# Altium project Cell Characterization Board V1.PrjPcb (part 1 of 2)
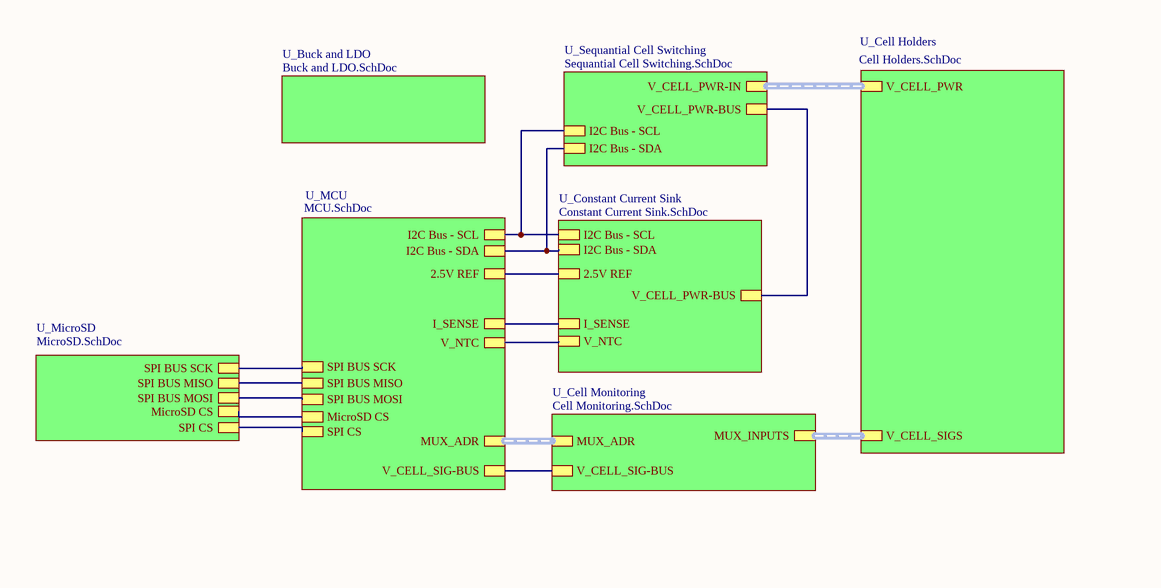
[diagram p0: TopLevel.SchDoc, top left]
CAGE_CODE: ?????; CONTRACT_NUMBER: <CONTRACT NO>; DOC_NO_ASSY_DWG: <ASSY DWG NO>; DOC_NO_BOM: <BOM DOC NO>; DOC_NO_FAB_DWG: <FAB DWG NO>; DOC_NO_SCH_DWG: <SCH DWG NO>; PCB_2_DEC_TOL: +/-.01; PCB_3_DEC_TOL: +/-.010; PCB_ANG_TOL: +/-1/2; PCB_ASSEMBLY_NO: <PCB ASSY NO>; PCB_CHECKER: - -----; PCB_CHECKER_APP_DATE: --/--/----; PCB_DESIGNER: - -----; PCB_DESIGNER_APP_DATE: --/--/----; PCB_DWG_NO: <PCB DWG NO>; PCB_ENGINEER: - -----; PCB_ENGINEER_APP_DATE: --/--/----; PCB_PART_NUMBER: <PCB PN>; PCB_REV: A; SCH_REV: A
8 sheets, 142 parts. Net scope: hierarchical (ports join the sheet entries above them; power ports are global).
Board file: Cell Characterization Board V1.2.PcbDoc
Sheets:
  TopLevel.SchDoc
    U_Buck and LDO = Buck and LDO.SchDoc
    U_Cell Holders = Cell Holders.SchDoc
    U_Cell Monitoring = Cell Monitoring.SchDoc
    U_Constant Current Sink = Constant Current Sink.SchDoc
    U_MCU = MCU.SchDoc
    U_MicroSD = MicroSD.SchDoc
    U_Sequantial Cell Switching = Sequantial Cell Switching.SchDoc

## Sheet TopLevel.SchDoc
size A; SheetNumber: 1; SheetTotal: 8

### Sub-sheets
U_Buck and LDO = Buck and LDO.SchDoc: no entries
U_Cell Holders = Cell Holders.SchDoc: V_CELL_SIGS (harness CELL_SIGS), V_CELL_PWR (harness CELL_PWR)
U_Cell Monitoring = Cell Monitoring.SchDoc: V_CELL_SIG-BUS, MUX_INPUTS (harness CELL_SIGS), MUX_ADR (harness MUX_ADR)
U_Constant Current Sink = Constant Current Sink.SchDoc: I2C Bus - SCL, I2C Bus - SDA, 2.5V REF, I_SENSE, V_NTC, V_CELL_PWR-BUS
U_MCU = MCU.SchDoc: SPI CS, 2.5V REF, MicroSD CS, SPI BUS MOSI, V_CELL_SIG-BUS, SPI BUS MISO, SPI BUS SCK, I2C Bus - SDA, I2C Bus - SCL, I_SENSE, V_NTC, MUX_ADR (harness MUX_ADR)
U_MicroSD = MicroSD.SchDoc: SPI CS, SPI BUS SCK, SPI BUS MISO, SPI BUS MOSI, MicroSD CS
U_Sequantial Cell Switching = Sequantial Cell Switching.SchDoc: I2C Bus - SCL, I2C Bus - SDA, V_CELL_PWR-BUS, V_CELL_PWR-IN (harness CELL_PWR)

### Nets
2.5V REF: sheet U_Constant Current Sink/2.5V REF, sheet U_MCU/2.5V REF
I2C_SCL: sheet U_Constant Current Sink/I2C Bus - SCL, sheet U_MCU/I2C Bus - SCL, sheet U_Sequantial Cell Switching/I2C Bus - SCL
I2C_SDA: sheet U_Constant Current Sink/I2C Bus - SDA, sheet U_MCU/I2C Bus - SDA, sheet U_Sequantial Cell Switching/I2C Bus - SDA
I_SENSE: sheet U_Constant Current Sink/I_SENSE, sheet U_MCU/I_SENSE
MicroSD_CS 5V: sheet U_MCU/MicroSD CS, sheet U_MicroSD/MicroSD CS
MOSFET_Temp: sheet U_Constant Current Sink/V_NTC, sheet U_MCU/V_NTC
MUX_OUT: sheet U_Cell Monitoring/V_CELL_SIG-BUS, sheet U_MCU/V_CELL_SIG-BUS
SPI_CS: sheet U_MCU/SPI CS, sheet U_MicroSD/SPI CS
SPI_MISO 5V: sheet U_MCU/SPI BUS MISO, sheet U_MicroSD/SPI BUS MISO
SPI_MOSI 5V: sheet U_MCU/SPI BUS MOSI, sheet U_MicroSD/SPI BUS MOSI
SPI_SCK 5V: sheet U_MCU/SPI BUS SCK, sheet U_MicroSD/SPI BUS SCK
NetMOSFET_CC_2: sheet U_Constant Current Sink/V_CELL_PWR-BUS, sheet U_Sequantial Cell Switching/V_CELL_PWR-BUS

### Buses and harness runs
harness sheet U_Cell Holders/V_CELL_PWR = sheet U_Sequantial Cell Switching/V_CELL_PWR-IN
harness sheet U_Cell Holders/V_CELL_SIGS = sheet U_Cell Monitoring/MUX_INPUTS
harness sheet U_Cell Monitoring/MUX_ADR = sheet U_MCU/MUX_ADR

## Sheet Buck and LDO.SchDoc
size A; SheetNumber: 2; SheetTotal: 8
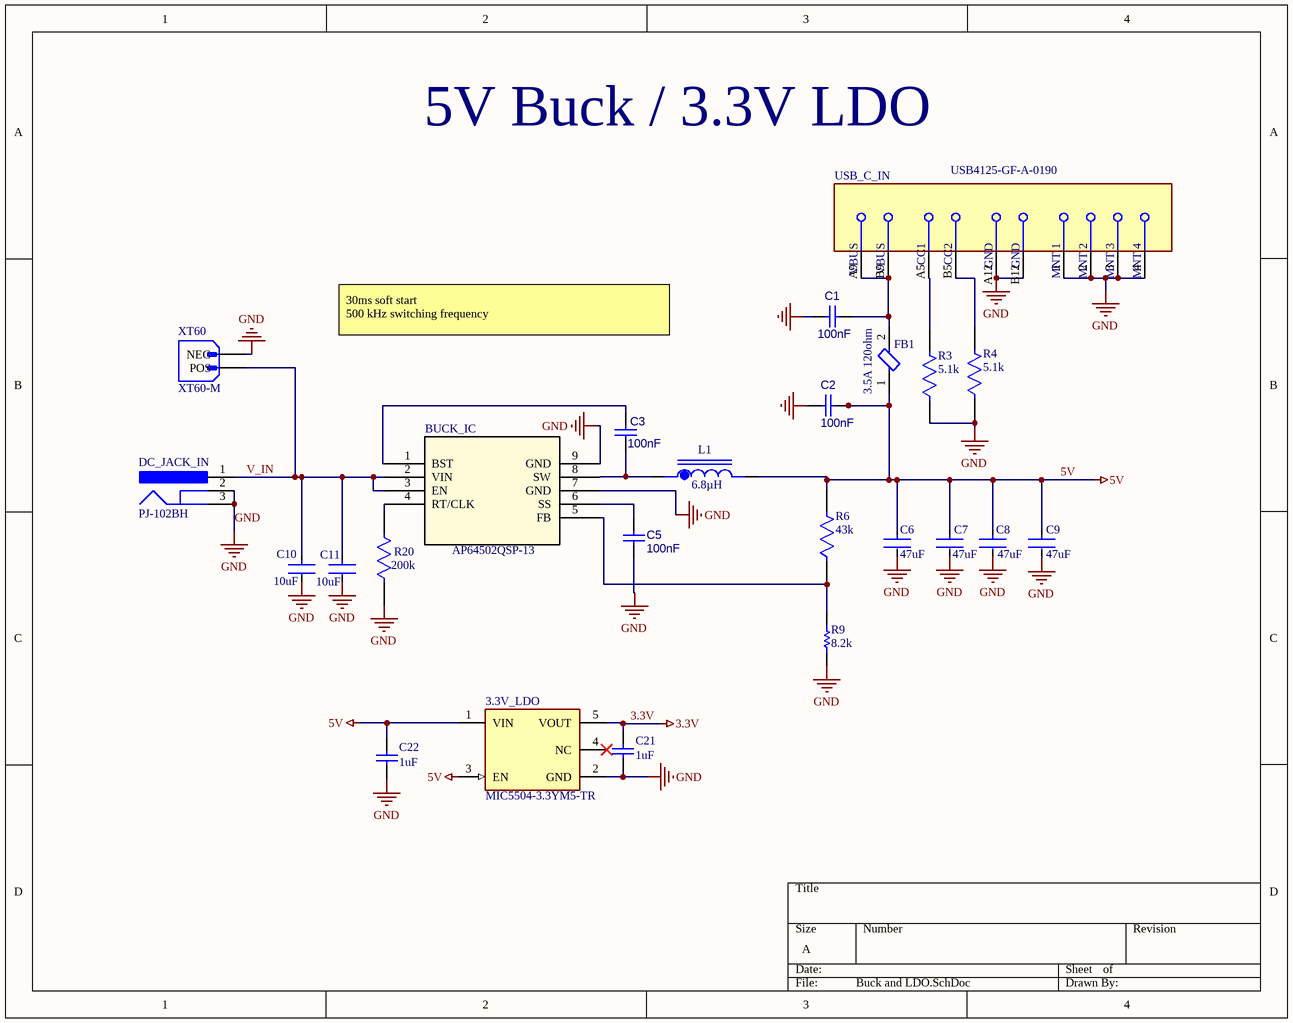
[diagram p1: Buck and LDO.SchDoc]

### Parts
3.3V_LDO  MIC5504-3.3YM5-TR  [FP-SOT23-5LD-PL-1-MFG]
BUCK_IC  AP64502QSP-13  [SO-8EP_DIO]
C1  100nF  [CAPC2013X95X50LL10T25]
C2  100nF  [CAPC2013X95X50LL10T25]
C3  100nF  [CAPC2013X95X50LL10T25]
C5  100nF  [CAPC2013X95X50LL10T25]
C6  47uF  [FP-GRM31C-0_2-e0_3_0_8-IPC_C]
C7  47uF  [FP-GRM31C-0_2-e0_3_0_8-IPC_C]
C8  47uF  [FP-GRM31C-0_2-e0_3_0_8-IPC_C]
C9  47uF  [FP-GRM31C-0_2-e0_3_0_8-IPC_C]
C10  10uF  [FP-CL31-IPC_C]
C11  10uF  [FP-CL31-IPC_C]
C21  1uF  [CAPC3216X180X50ML20T25]
C22  1uF  [CAPC3216X180X50ML20T25]
DC_JACK_IN  PJ-102BH  [CUI-PJ-102BH_V]
FB1  3.5A 120ohm  [FP-BLM31-0_2-t1_1-MFG]
L1  value 6.8µH  [IND_MGAH06036R8M-10]  (hidden comment: MGAH06036R8M-10)
R3  5.1k  [FP-MCT0603-IPC_B]
R4  5.1k  [FP-MCT0603-IPC_B]
R6  43k  [FP-MCU0805-IPC_C]
R9  8.2k  [RESC0805(2012)_N]
R20  200k  [FP-CRCW0603-HPe3-MFG]
USB_C_IN  USB4125-GF-A-0190  [FP-USB4125-GF-A-0190-MFG]
XT60  XT60-M  [AMASS_XT60-M]

### Nets
3.3V: 3.3V_LDO.5(VOUT) C21.2
5V: 3.3V_LDO.1(VIN) 3.3V_LDO.3(EN) C2.2 C6.1 C7.1 C8.1 C9.1 C22.2 FB1.1 L1.2 R6.2
GND: 3.3V_LDO.2(GND) BUCK_IC.7(GND) BUCK_IC.9(GND) C1.1 C2.1 C5.1 C6.2 C7.2 C8.2 C9.2 C10.2 C11.2 C21.1 C22.1 DC_JACK_IN.2 DC_JACK_IN.3 R3.1 R4.1 R9.1 R20.1 USB_C_IN.1(MNT_1) USB_C_IN.2(MNT_2) USB_C_IN.3(MNT_3) USB_C_IN.4(MNT_4) USB_C_IN.A12(GND) USB_C_IN.B12(GND) XT60.N(NEG)
V_IN: BUCK_IC.2(VIN) BUCK_IC.3(EN) C10.1 C11.1 DC_JACK_IN.1 XT60.P(POS)
NetBUCK_IC_1: BUCK_IC.1(BST) C3.2
NetBUCK_IC_4: BUCK_IC.4(RT/CLK) R20.2
NetBUCK_IC_5: BUCK_IC.5(FB) R6.1 R9.2
NetBUCK_IC_6: BUCK_IC.6(SS) C5.2
NetBUCK_IC_8: BUCK_IC.8(SW) C3.1 L1.1
NetC1_2: C1.2 FB1.2 USB_C_IN.A9(VBUS) USB_C_IN.B9(VBUS)
NetR3_2: R3.2 USB_C_IN.A5(CC1)
NetR4_2: R4.2 USB_C_IN.B5(CC2)

Not connected (* = marked no-connect by the designer): 3.3V_LDO 4(NC)*

### Notes on the sheet
- 5V Buck / 3.3V LDO
- 30ms soft start
  500 kHz switching frequency

### Library data of the parts
3.3V_LDO = CMP-2000-07604-2: IC REG LINEAR 3.3V 300MA SOT23-5; Quiescent Current: 38uA; Operating Supply Current: 42uA; Max Input Voltage: 5.5V; Min Input Voltage: 2.5V; Output Type: Fixed; Power Supply Rejection Ratio (PSRR): 60dB; Dropout Voltage: 380mV; Accuracy: 3%; Number of Outputs: 1; Nominal Output Voltage: 3.3V; Max Output Current: 300mA; Length: 2.9mm; Mount: Surface Mount; Width: 1.6mm; Packaging: Tape and Reel; Output Current: 300mA; Min Operating Temperature: -40°C; Max Operating Temperature: 125°C; Height: 1.1mm; Case/Package: SOT-23-5; REACH SVHC: No SVHC; Number of Pins: 5; Output Voltage: 3.3V
BUCK_IC = AP64502QSP-13: Description; Manufacturer_Name: Diodes Inc; Copyright: Copyright (C) 2025 Ultra Librarian. All rights reserved.; Manufacturer_Part_Number: AP64502QSP-13; RefDes: RefDes; Type: Type; Supplier 1: Avnet; Supplier Part Number 1: AP64502QSP-13
C1-C3 C5 = CMP-001-00018-6: Capacitor 100 nF +/-10% 50 V 0805; Voltage Rating: 50V; Tolerance: 10%; Capacitor Type: Ceramic; Value: 100nF; Pins: 2; Max Operating Temperature: 125°C; Min Operating Temperature: -55°C; Mounting Technology: SM; Case/Package: 0805; RoHS Compliant: True
C6-C9 = CMP-2000-05255-3: Chip Multilayer Ceramic Capacitors for General Purpose, 1206, 47uF, X5R, 15%, 20%, 10V; Case/Package: 1206; Radiation Hardening: No; Case Code (Metric): 3216; Max Operating Temperature: 85°C; Capacitance: 47uF; Tolerance: 20%; REACH SVHC: No SVHC; Depth: 1.6mm; Case Code (Imperial): 1206; Termination: SMD/SMT; Voltage Rating (DC): 10V; Package Quantity: 2000; Voltage Rating: 10V; Width: 1.6mm; Lead Free: Lead Free; Voltage: 10V; Packaging: Tape and Reel; Length: 3.2mm; Height: 1.6mm; Number of Pins: 2; Thickness: 0.071inch; Min Operating Temperature: -55°C; Dielectric: X5R; Mount: Surface Mount
C10 C11 = CMP-13271-000016-1: CAP CER 10UF 50V X5R 1206; Manufacturer: Samsung; Manufacturer Part Number: CL31A106KBHNNNE; Tolerance: 10%; Material: Ceramic; Temperature Coefficient: 15%; RoHS: TRUE; Ipc Land Pattern Name: CAPC320160X160; Temperature Range Low: -55°C; Value: 10uF; Device Class L3: Ceramic Capacitors; Category: Cap; Temperature Characteristic: X5R; Lead Free: Yes; Device Class L2: Capacitors; Octopart: https://octopart.com/cl31a106kbhnnne-samsung-19832778; ComponentLink2Description: Datasheet; Digikey Description: CAP CER 10UF 50V X5R 1206; Voltage: 50V; ComponentLink2URL: http://www.samsungsem.com/kr/support/product-search/mlcc/__icsFiles/afieldfile/2018/06/21/CL31A106KBHNNNE.pdf; Capacitance: 10uF; Temperature Range High: +85°C; Device Class L1: Passive Components; Height: 1.8mm; Automotive: No; Voltage Rating: 50V; Package: CL31; Temperature: -55°C to +85°C
C21 C22 = CMP-2000-04991-1: Chip Capacitor, 1 uF, +/- 10%, 25 V, -55 to 125 degC, 1206 (3216 Metric), RoHS, Tape and Reel; Manufacturer: Kemet; Temperature Coefficient / Code: +/-15%; Dielectric: X7R; Voltage Rating DC: 25V; Capacitance - nF: 1000nF; Class: Class1; Case Length: 3.2mm; Type: SMDMLCCX7R6.3-250VDCCommericalGrade; Case Width: 1.6mm; Product: GeneralTypeMLCCs; Capacitance: 1uF; Datasheet URL: https://ciiva.com/datasheet-click-18194173?src=ciiva&sig=6daff8c4; Operating Temperature Range: -55Cto+125C; Series: C1206C; RoHS: Details; Product Category: MultilayerCeramicCapacitorsMLCC-SMD/SMT; Manufacturer URL: http://www.kemet.com/; Minimum Operating Temperature: -55C; Dimensions: 1.6mmWx3.2mmLx1.6mmH; Termination Style: SMD/SMT; Brand: Kemet; Packaging: Reel; Package / Case: 1206(3216metric); Case Code - mm: 3216; Datasheet Version: Jul-14; Factory Pack Quantity: 2000; Package Description: 2-Pin Surface Mount Device, Body 3.2 x 1.6 mm; Tolerance: 10%; Package Reference: 1206; Case Height: 1.6mm; Case Code - in: 1206; Maximum Operating Temperature: +125C; Voltage Rating: 25V
DC_JACK_IN = CMP-2000-06901-1: Through Hole Right Angle DC Power Jack, 5 A, 2.5 mm Center Pin, 3 Position, -25 to 85 degC, RoHS, Bulk; Manufacturer: CUIInc.; Outside Contact Diameter: 6.5mm; Current Rating: 5A; Brand: CUI; Insulation Resistance: 100MOhms; Inside Contact Diameter: 2.5mm; Voltage Rating: 24V; Operating Temperature Range: -25Cto+85C; Mounting Angle: Right; Mounting Technology: ThroughHole; Product Category: DCPowerConnectors; Datasheet Version: Rev. 1.02, 05/2016; Connector Type: DCPowerJack; Contact Material: Copper; Housing Material: PolybutyleneTerephthalate(PBT); Mounting Style: ThroughHole; Product: Jacks; Package Reference: PJ-102BH; Manufacturer URL: http://www.cui.com/; RoHS: True; Contact Gender: Male; Contact Plating: Nickel; Flammability Rating: UL94V-0; Factory Pack Quantity: 280; Datasheet URL: http://www.cui.com/product/resource/pj-102bh.pdf; Package Description: 3-Pin Through Hole Device, Body 14.4 x 9 mm, Height 11 mm; Termination Style: ThroughHole
FB1 = CMP-0686-00732-3: BLM31PG121SN1L Chip Ferrite Bead Array, 1206, 120Ω @ 100MHz, 0.02Ω, 25%, 3.5A; Number of Lines: 1; DC Current: 3A; Impedance: 120R; Material: Steel; DC Resistance (DCR): 20mR; Shielding: Unshielded; Number of Pins: 2; Case Code (Metric): 3216; Contact Plating: Tin; Radiation Hardening: No; Termination: SMD/SMT; Lead Free: Lead Free; Core Material: Ferrite; Case Code (Imperial): 1206; Test Frequency: 100MHz; Depth: 1.6mm; Max Operating Temperature: 125°C; Package Quantity: 3000; Packaging: Tape and Reel; Min Operating Temperature: -55°C; Length: 3.2mm; Current Rating: 3.5A; RoHS Compliant: Yes; Tolerance: 25%; Width: 1.6mm; Max Current Rating: 3.5A; Frequency: 100MHz; Military Standard: Not; Case/Package: 1206; Max DC Current: 3A; Height: 1.1mm
L1 = CMP-006-00023-1: 6.8 ÂµH Shielded Molded Inductor 5 A 50mOhm Max Nonstandard; MF: Laird-Signal Integrity Products; SnapEDA_Link: https://www.snapeda.com/parts/MGAH06036R8M-10/Laird/view-part/?ref=snap; Price: None; Availability: In Stock; Pins: 2; Design Item ID: MGAH06036R8M-10; Check_prices: https://www.snapeda.com/parts/MGAH06036R8M-10/Laird/view-part/?ref=eda; Component Type: Standard; Case/Package: None; Purchase-URL: https://pricing.snapeda.com/search/part/MGAH06036R8M-10/?ref=eda; MP: MGAH06036R8M-10; Source: MGAH06036R8M-10.SchLib
R3 R4 = CMP-02407-010205-1: MCT06030D5101BP500 RES SMD 5100 OHM 1% 1/8W 0603; Resistance: 5.1kR; Tolerance: 0.1%; Temperature Coefficient: 25ppm/°C; Max Operating Temperature: 125°C; Radiation Hardening: No; Composition: Thin Film; Height: 450um; Lead Free: Lead Free; Contact Plating: Tin; Length: 1.55mm; Width: 850um; Case/Package: 0603; Min Operating Temperature: -55°C
R6 = CMP-02407-010835-1: MCU08050C4302FP500 RES 1.05K OHM 0.5% 1/5W 0805; Tolerance: 1%; Resistance: 43000R; Height: 450um; Lead Free: Lead Free; Length: 2mm; Case/Package: 0805; Width: 1.25mm
R9 = CMP-1013-00613-1: 8K2 0.125W 1% 0805 (2012 Metric)  SMD; Value: 8200.00 Ohm; Case-EIA: 0805; Case-Metric: 2012; Power: 0.125 W; Tolerance: 1 %; Technology: SMT
R20 = CMP-02407-007717-1: RES Thick Film, 200kΩ, 1%, 0.33W, 100ppm/°C, 0603; Resistance: 200kR; Max Power Dissipation: 250mW; Tolerance: 1%; Composition: Thick Film; Features: Automotive AEC-Q200; Min Operating Temperature: -55°C; Case/Package: 0603; Length: 0.063inch; Max Operating Temperature: 155°C; Number of Terminations: 2; Height: 0.022inch; Military Standard: Not; Package Quantity: 5000; Width: 0.033inch; Temperature Coefficient: 100ppm/°C; Lead Free: Lead Free; Packaging: Tape and Reel; Depth: 0.85mm
USB_C_IN = CMP-245163-000004-1: CONN RCPT TYPE C 6P SMD RA
XT60 = CMP-002-00073-1: Plug; DC supply; XT60; male; PIN: 2; for cable; soldered; 30A; 500V; MF: AMASS; Design Item ID: XT60-M; Component Type: Standard; Case/Package: Package; MP: XT60-M; Value: *; Pins: 2; Check_prices: https://www.snapeda.com/parts/XT60-M/AMASS/view-part/?ref=eda; Source: XT60-M.SchLib; SnapEDA_Link: https://www.snapeda.com/parts/XT60-M/AMASS/view-part/?ref=snap

## Sheet Cell Holders.SchDoc
size A4; SheetNumber: 4; SheetTotal: 8
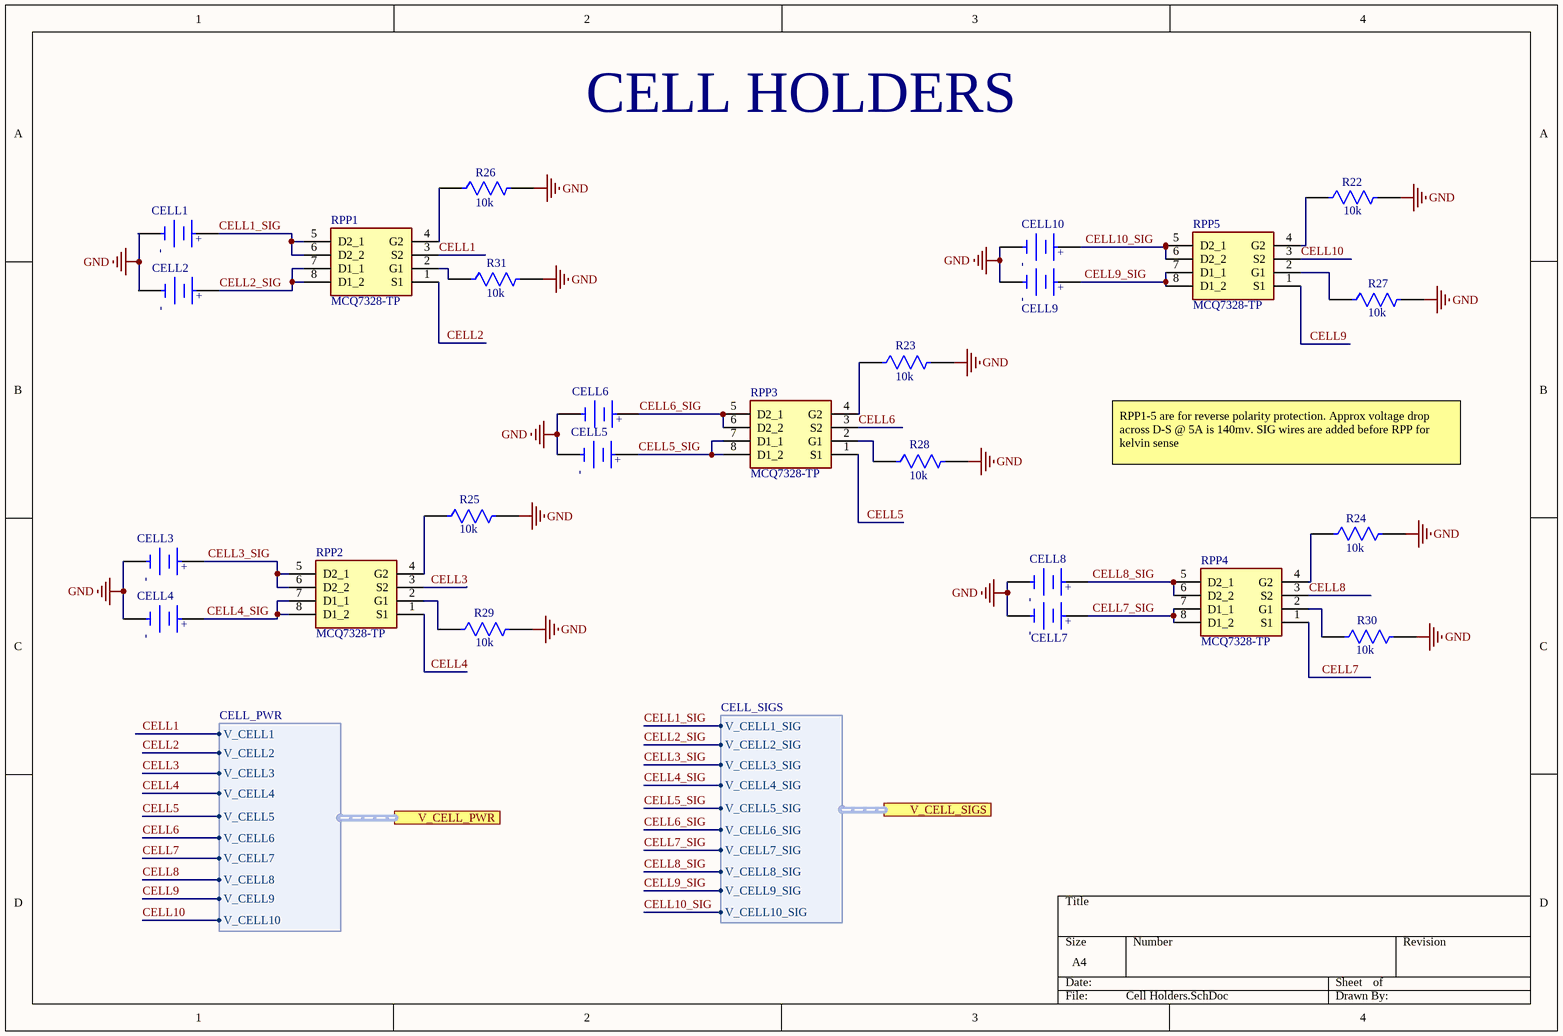
[diagram p2: Cell Holders.SchDoc]

### Parts
CELL1  1042P  [FP-1042P-MFG]  (value not drawn)
CELL2  1042P  [FP-1042P-MFG]  (value not drawn)
CELL3  1042P  [FP-1042P-MFG]  (value not drawn)
CELL4  1042P  [FP-1042P-MFG]  (value not drawn)
CELL5  1042P  [FP-1042P-MFG]  (value not drawn)
CELL6  1042P  [FP-1042P-MFG]  (value not drawn)
CELL7  1042P  [FP-1042P-MFG]  (value not drawn)
CELL8  1042P  [FP-1042P-MFG]  (value not drawn)
CELL9  1042P  [FP-1042P-MFG]  (value not drawn)
CELL10  1042P  [FP-1042P-MFG]  (value not drawn)
R22  10k  [FP-AC0603-IPC_A]
R23  10k  [FP-AC0603-IPC_A]
R24  10k  [FP-AC0603-IPC_A]
R25  10k  [FP-AC0603-IPC_A]
R26  10k  [FP-AC0603-IPC_A]
R27  10k  [FP-AC0603-IPC_A]
R28  10k  [FP-AC0603-IPC_A]
R29  10k  [FP-AC0603-IPC_A]
R30  10k  [FP-AC0603-IPC_A]
R31  10k  [FP-AC0603-IPC_A]
RPP1  MCQ7328-TP  [SOIC127P600X175-8N]
RPP2  MCQ7328-TP  [SOIC127P600X175-8N]
RPP3  MCQ7328-TP  [SOIC127P600X175-8N]
RPP4  MCQ7328-TP  [SOIC127P600X175-8N]
RPP5  MCQ7328-TP  [SOIC127P600X175-8N]

### Ports
V_CELL_PWR (harness CELL_PWR), V_CELL_SIGS (harness CELL_SIGS)

### Harnesses
CELL_PWR: V_CELL1, V_CELL2, V_CELL3, V_CELL4, V_CELL5, V_CELL6, V_CELL7, V_CELL8, V_CELL9, V_CELL10
CELL_SIGS: V_CELL1_SIG, V_CELL2_SIG, V_CELL3_SIG, V_CELL4_SIG, V_CELL5_SIG, V_CELL6_SIG, V_CELL7_SIG, V_CELL8_SIG, V_CELL9_SIG, V_CELL10_SIG

### Nets
GND: CELL1.1(C) CELL3.1(C) CELL4.1(C) CELL5.1(C) CELL6.1(C) CELL7.1(C) CELL8.1(C) CELL9.1(C) CELL10.1(C) R22.2 R23.2 R24.2 R25.2 R26.2 R27.2 R28.2 R29.2 R30.2 R31.2
CELL1: RPP1.3(S2) ; port V_CELL_PWR.V_CELL1
CELL1_SIG: CELL1.2(A) RPP1.5(D2_1) RPP1.6(D2_2) ; port V_CELL_SIGS.V_CELL1_SIG
CELL2: RPP1.1(S1) ; port V_CELL_PWR.V_CELL2
CELL2_SIG: CELL2.2(A) RPP1.7(D1_1) RPP1.8(D1_2) ; port V_CELL_SIGS.V_CELL2_SIG
CELL3: RPP2.3(S2) ; port V_CELL_PWR.V_CELL3
CELL3_SIG: CELL3.2(A) RPP2.5(D2_1) RPP2.6(D2_2) ; port V_CELL_SIGS.V_CELL3_SIG
CELL4: RPP2.1(S1) ; port V_CELL_PWR.V_CELL4
CELL4_SIG: CELL4.2(A) RPP2.7(D1_1) RPP2.8(D1_2) ; port V_CELL_SIGS.V_CELL4_SIG
CELL5: RPP3.1(S1) ; port V_CELL_PWR.V_CELL5
CELL5_SIG: CELL5.2(A) RPP3.7(D1_1) RPP3.8(D1_2) ; port V_CELL_SIGS.V_CELL5_SIG
CELL6: RPP3.3(S2) ; port V_CELL_PWR.V_CELL6
CELL6_SIG: CELL6.2(A) RPP3.5(D2_1) RPP3.6(D2_2) ; port V_CELL_SIGS.V_CELL6_SIG
CELL7: RPP4.1(S1) ; port V_CELL_PWR.V_CELL7
CELL7_SIG: CELL7.2(A) RPP4.7(D1_1) RPP4.8(D1_2) ; port V_CELL_SIGS.V_CELL7_SIG
CELL8: RPP4.3(S2) ; port V_CELL_PWR.V_CELL8
CELL8_SIG: CELL8.2(A) RPP4.5(D2_1) RPP4.6(D2_2) ; port V_CELL_SIGS.V_CELL8_SIG
CELL9: RPP5.1(S1) ; port V_CELL_PWR.V_CELL9
CELL9_SIG: CELL9.2(A) RPP5.7(D1_1) RPP5.8(D1_2) ; port V_CELL_SIGS.V_CELL9_SIG
CELL10: RPP5.3(S2) ; port V_CELL_PWR.V_CELL10
CELL10_SIG: CELL10.2(A) RPP5.5(D2_1) RPP5.6(D2_2) ; port V_CELL_SIGS.V_CELL10_SIG
NetR22_1: R22.1 RPP5.4(G2)
NetR23_1: R23.1 RPP3.4(G2)
NetR24_1: R24.1 RPP4.4(G2)
NetR25_1: R25.1 RPP2.4(G2)
NetR26_1: R26.1 RPP1.4(G2)
NetR27_1: R27.1 RPP5.2(G1)
NetR28_1: R28.1 RPP3.2(G1)
NetR29_1: R29.1 RPP2.2(G1)
NetR30_1: R30.1 RPP4.2(G1)
NetR31_1: R31.1 RPP1.2(G1)

Not connected (* = marked no-connect by the designer): CELL2 1(C)

### Notes on the sheet
- CELL HOLDERS
- RPP1-5 are for reverse polarity protection. Approx voltage drop across D-S @ 5A is 140mv. SIG wires are added before RPP for kelvin sense
- (in symbol CMP-19636-000019-1) +; -

### Library data of the parts
CELL1-CELL10 = CMP-19636-000019-1: BATTERY HOLDER 18650 SMD TAB; Number of Cells: 1; Max Operating Temperature: 145°C; Termination: SMD/SMT; Mount: Surface Mount; Min Operating Temperature: -50°C; Package Quantity: 200; Packaging: Tray; Lead Free: Lead Free
R22-R31 = CMP-03412-040683-1: RES 10kΩ 5.00% 0.2W 0603
RPP1-RPP5 = MCQ7328-TP: Integrated Circuit; Manufacturer_Name: MCC; Datasheet Link: https://www.mccsemi.com/pdf/Products/MCQ7328(SOP-8).pdf; Height: 1.75mm; Manufacturer_Part_Number: MCQ7328-TP

## Sheet Cell Monitoring.SchDoc
size A; SheetNumber: 8; SheetTotal: 8
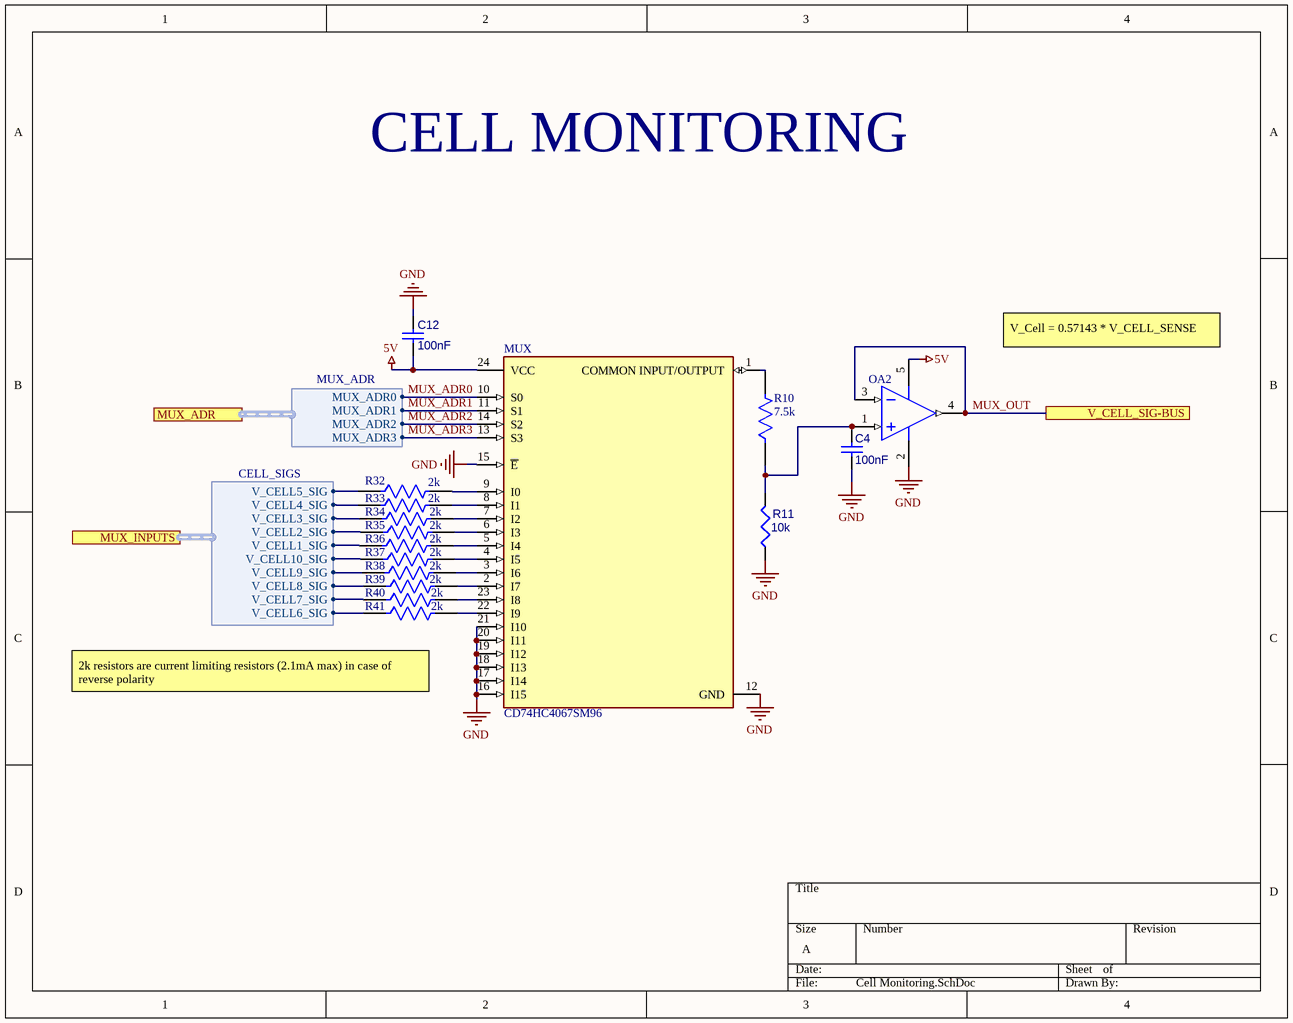
[diagram p3: Cell Monitoring.SchDoc]

### Parts
C4  100nF  [CAPC2013X95X50LL10T25]
C12  100nF  [CAPC2013X95X50LL10T25]
MUX  CD74HC4067SM96  [FP-DB0024A-IPC_C]
OA2  MCP6001UT-E/OT  [SOT-23-OT5_L]  (value not drawn)
R10  7.5k  [FP-CRCW0805-HPe3-IPC_B]
R11  10k  [RESC2013X50X35ML15T15]
R32  2k  [FP-TFCR0603-IPC_B]
R33  2k  [FP-TFCR0603-IPC_B]
R34  2k  [FP-TFCR0603-IPC_B]
R35  2k  [FP-TFCR0603-IPC_B]
R36  2k  [FP-TFCR0603-IPC_B]
R37  2k  [FP-TFCR0603-IPC_B]
R38  2k  [FP-TFCR0603-IPC_B]
R39  2k  [FP-TFCR0603-IPC_B]
R40  2k  [FP-TFCR0603-IPC_B]
R41  2k  [FP-TFCR0603-IPC_B]

### Ports
MUX_ADR (harness MUX_ADR), MUX_INPUTS (harness CELL_SIGS), V_CELL_SIG-BUS

### Harnesses
CELL_SIGS: V_CELL1_SIG, V_CELL2_SIG, V_CELL3_SIG, V_CELL4_SIG, V_CELL5_SIG, V_CELL6_SIG, V_CELL7_SIG, V_CELL8_SIG, V_CELL9_SIG, V_CELL10_SIG
MUX_ADR: MUX_ADR0, MUX_ADR1, MUX_ADR2, MUX_ADR3

### Nets
5V: C12.2 MUX.24(VCC) OA2.5(VDD)
GND: C4.2 C12.1 MUX.12(GND) MUX.15(~{E}) MUX.16(I15) MUX.17(I14) MUX.18(I13) MUX.19(I12) MUX.20(I11) MUX.21(I10) OA2.2(VSS) R11.1
CELL1_SIG: R36.1 ; port MUX_INPUTS.V_CELL1_SIG
CELL2_SIG: R35.1 ; port MUX_INPUTS.V_CELL2_SIG
CELL3_SIG: R34.1 ; port MUX_INPUTS.V_CELL3_SIG
CELL4_SIG: R33.1 ; port MUX_INPUTS.V_CELL4_SIG
CELL5_SIG: R32.1 ; port MUX_INPUTS.V_CELL5_SIG
CELL6_SIG: R41.1 ; port MUX_INPUTS.V_CELL6_SIG
CELL7_SIG: R40.1 ; port MUX_INPUTS.V_CELL7_SIG
CELL8_SIG: R39.1 ; port MUX_INPUTS.V_CELL8_SIG
CELL9_SIG: R38.1 ; port MUX_INPUTS.V_CELL9_SIG
CELL10_SIG: R37.1 ; port MUX_INPUTS.V_CELL10_SIG
MUX_ADR0: MUX.10(S0) ; port MUX_ADR.MUX_ADR0
MUX_ADR1: MUX.11(S1) ; port MUX_ADR.MUX_ADR1
MUX_ADR2: MUX.14(S2) ; port MUX_ADR.MUX_ADR2
MUX_ADR3: MUX.13(S3) ; port MUX_ADR.MUX_ADR3
MUX_OUT: OA2.3(VIN-) OA2.4(VOUT) ; port V_CELL_SIG-BUS
NetC4_1: C4.1 OA2.1(VIN+) R10.1 R11.2
NetMUX_1: MUX.1(COMMON_INPUT/OUTPUT) R10.2
NetMUX_2: MUX.2(I7) R39.2
NetMUX_3: MUX.3(I6) R38.2
NetMUX_4: MUX.4(I5) R37.2
NetMUX_5: MUX.5(I4) R36.2
NetMUX_6: MUX.6(I3) R35.2
NetMUX_7: MUX.7(I2) R34.2
NetMUX_8: MUX.8(I1) R33.2
NetMUX_9: MUX.9(I0) R32.2
NetMUX_22: MUX.22(I9) R41.2
NetMUX_23: MUX.23(I8) R40.2

### Notes on the sheet
- CELL MONITORING
- V_Cell = 0.57143 * V_CELL_SENSE
- 2k resistors are current limiting resistors (2.1mA max) in case of reverse polarity

### Library data of the parts
C4 C12 = CMP-001-00018-6: as C1 on sheet Buck and LDO; Value: 100nF; Pins: 2; Max Operating Temperature: 125°C; Min Operating Temperature: -55°C; Mounting Technology: SM; Case/Package: 0805; RoHS Compliant: True
MUX = CMP-04892-000038-1: IC MUX/DEMUX 1X16 24SSOP; Supply Type: Single; High Level Output Current: 25mA; Min Supply Voltage: 2V; Number of Circuits: 16; Max Supply Voltage: 6V; Number of Channels: 1; Turn-On Delay Time: 300ns; Max Supply Current: 8uA; Bandwidth: 89MHz; Turn-Off Delay Time: 290ns; Propagation Delay: 75ns; Logic Function: Multiplexer; On-State Resistance: 160R; Polarity: Non-Inverting; Width: 5.3mm; Case/Package: SSOP; Max Operating Temperature: 125°C; Mount: Surface Mount; Min Operating Temperature: -55°C; REACH SVHC: No SVHC; Contact Plating: Gold; Max Output Current: 25mA; Weight: 0.006081oz; Height: 1.95mm; Package Quantity: 2000; Length: 8.2mm; Lead Free: Lead Free; Operating Supply Current: 8uA; Packaging: Tape and Reel; Series: 74HC; Low Level Output Current: 25mA; Number of Outputs: 1; Termination: SMD/SMT; Number of Inputs: 16; Number of Bits: 16; Radiation Hardening: No; Number of Pins: 24
OA2 = CMP-0187-00480-3: None; Number of Channels: 1; Max Supply Voltage: 6V; Slew Rate: 0.6V/µs; Common Mode Rejection Ratio: 60dB; Gain Bandwidth Product: 1MHz; Amplifier Type: GENERAL PURPOSE; Power Supply Rejection Ratio (PSRR): 86dB; Supply Current: 100uA; Voltage Gain: 112dB; Input Bias Current: 1pA; Output Current: 23mA; Min Supply Voltage: 1.8V; Operating Supply Voltage: 5.5V; Input Offset Voltage-Max: 4.5mV; REACH SVHC: No SVHC; Number of Amplifiers: 1; Max Operating Temperature: 125°C; RoHS Compliant: Yes; Min Operating Temperature: -40°C; Number of Elements: 1; Slew Rate-Nom: 0.6V/µs; Mount: Surface Mount; Package Quantity: 3000; Number of Circuits: 1; Lead Free: Lead Free; Height: 1.3mm; Number of Pins: 5; Nominal Supply Current: 100uA; Radiation Hardening: No; Length: 3.1mm; Width: 1.8mm; Packaging: Tape and Reel; Unity Gain Bandwidth Product: 1MHz; Case/Package: SOT-23; Bandwidth: 1MHz; Input Offset Voltage (Vos): 4.5mV; Technology: CMOS
R10 = CMP-02407-001990-1: CRCW08057K50FKEAHP RES Thick Film, 7.5kΩ, 1%, 0.5W, 100ppm/°C, 0805; Resistance: 7.5kR; Max Power Dissipation: 500mW; Height: 0.024inch; Max Operating Temperature: 155°C; Tolerance: 1%; Case/Package: 0805; Lead Free: Lead Free; Min Operating Temperature: -55°C; Military Standard: Not; Length: 0.079inch; Temperature Coefficient: 100ppm/°C; Package Quantity: 5000; Depth: 1.25mm; Width: 0.049inch; Packaging: Tape and Reel; Composition: Thick Film; Features: Automotive AEC-Q200; Number of Terminations: 2; Contact Plating: Tin
R11 = CMP-009-00018-5: Chip Resistor, 10 KOhm, +/- 1%, 125 mW, -55 to 155 degC, 0805 (2012 Metric); Power: 125mW; Voltage Rating: 150V; Tolerance: 1%; Pins: 2; Min Operating Temperature: -55°C; Case/Package: 0805; Max Operating Temperature: 155°C; RoHS Compliant: True; Mounting Technology: SM
R32-R41 = CMP-250906-173560-1: TFCR0603-10W-E-2001BT

## Sheet Constant Current Sink.SchDoc
size A4; SheetNumber: 3; SheetTotal: 8
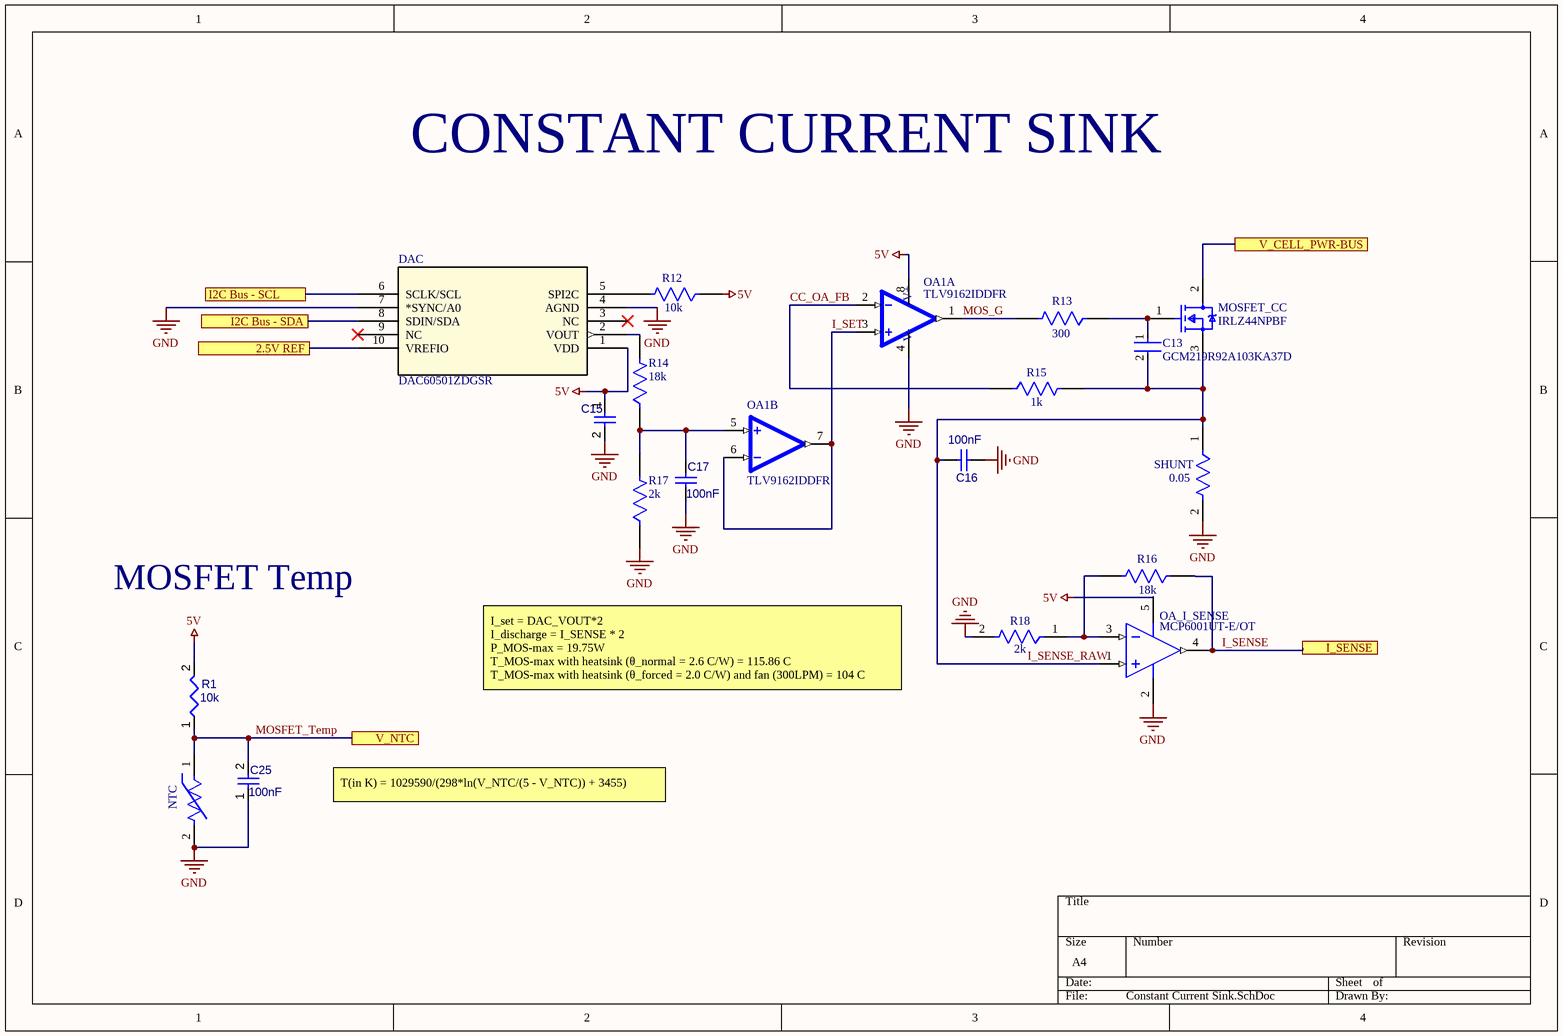
[diagram p4: Constant Current Sink.SchDoc]

### Parts
C13  GCM219R92A103KA37D  [FP-GCM219-0_15-IPC_C]
C15  100nF  [CAPC2013X95X50LL10T25]  (value not drawn)
C16  100nF  [CAPC2013X95X50LL10T25]
C17  100nF  [CAPC2013X95X50LL10T25]
C25  100nF  [CAPC2013X95X50LL10T25]
DAC  DAC60501ZDGSR  [DGS10_TEX]
MOSFET_CC  IRLZ44NPBF  [FP-PG-TO220-3-MFG]
NTC  NXRT15XH103FA1B030  [FP-NXR_151B030-MFG]  (value not drawn)
OA1  TLV9162IDDFR  [SOT65P280X110-8N]  (parts A,B of 2)
OA_I_SENSE  MCP6001UT-E/OT  [SOT-23-OT5_L]
R1  10k  [RESC2013X50X35ML15T15]
R12  10k  [FP-AC0603-IPC_A]
R13  300  [FP-CR0805-MFG]
R14  18k  [FP-CRGP0805-IPC_C]
R15  1k  [FP-RN73R2A-IPC_A]
R16  18k  [FP-CRGP0805-IPC_C]
R17  2k  [FP-MCU0805-IPC_A]
R18  2k  [FP-MCU0805-IPC_A]
SHUNT  0.05  [FP-CRA2512-IPC_A]

### Ports
2.5V REF, I2C Bus - SCL, I2C Bus - SDA, I_SENSE, V_CELL_PWR-BUS, V_NTC

### Nets
5V: C15.1 DAC.1(VDD) OA1.8(V+) OA_I_SENSE.5(VDD) R1.2 R12.1
GND: C15.2 C16.2 C17.2 C25.1 DAC.4(AGND) DAC.7(*SYNC/A0) NTC.2 OA1.4(V-) OA_I_SENSE.2(VSS) R17.1 R18.2 SHUNT.2
2.5V REF: DAC.10(VREFIO) ; port 2.5V REF
CC_OA_FB: OA1.2(IN1-) R15.1
I2C_SCL: DAC.6(SCLK/SCL) ; port I2C Bus - SCL
I2C_SDA: DAC.8(SDIN/SDA) ; port I2C Bus - SDA
I_SENSE: OA_I_SENSE.4(VOUT) R16.1 ; port I_SENSE
I_SENSE_RAW: C13.2 C16.1 MOSFET_CC.3(S) OA_I_SENSE.1(VIN+) R15.2 SHUNT.1
I_SET: OA1.3(IN1+) OA1.6(IN2-) OA1.7(OUT2)
MOS_G: OA1.1(OUT1) R13.2
MOSFET_Temp: C25.2 NTC.1 R1.1 ; port V_NTC
NetC13_1: C13.1 MOSFET_CC.1(G) R13.1
NetC17_1: C17.1 OA1.5(IN2+) R14.1 R17.2
NetDAC_2: DAC.2(VOUT) R14.2
NetDAC_5: DAC.5(SPI2C) R12.2
NetMOSFET_CC_2: MOSFET_CC.2(D) ; port V_CELL_PWR-BUS
NetOA_I_SENSE_3: OA_I_SENSE.3(VIN-) R16.2 R18.1

Not connected (* = marked no-connect by the designer): DAC 3(NC)* 9(NC)*

### Notes on the sheet
- CONSTANT CURRENT SINK
- MOSFET Temp
- I_set = DAC_VOUT*2
  I_discharge = I_SENSE * 2
  P_MOS-max = 19.75W
  T_MOS-max with heatsink (θ_normal = 2.6 C/W) = 115.86 C
  T_MOS-max with heatsink (θ_forced = 2.0 C/W) and fan (300LPM) = 104 C
- T(in K) = 1029590/(298*ln(V_NTC/(5 - V_NTC)) + 3455)

### Library data of the parts
C13 = CMP-06035-023057-1: Ceramic Capacitor for Automotive 10nF  ±10% 100VDC X8R 0805 Paper T/R
C15-C17 C25 = CMP-001-00018-6: as C1 on sheet Buck and LDO; Value: 100nF; Pins: 2; Max Operating Temperature: 125°C; Min Operating Temperature: -55°C; Mounting Technology: SM; Case/Package: 0805; RoHS Compliant: True
DAC = DAC60501ZDGSR: True 12-bit, 1-ch, SPI/I2C, voltage-output DAC in WSON package with precision internal reference 10-VSSOP -40 to 125; Manufacturer_Name: Texas Instruments; Copyright: Copyright (C) 2025 Ultra Librarian. All rights reserved.; Manufacturer_Part_Number: DAC60501ZDGSR; RefDes: RefDes; Type: Type
MOSFET_CC = CMP-32901-000488-1: MOSFET N-CH 55V 47A TO220AB; Turn-On Delay Time: 11ns; Gate to Source Voltage (Vgs): 16V; Element Configuration: Single; Rds On Max: 22mR; Turn-Off Delay Time: 26ns; Max Power Dissipation: 110W; Threshold Voltage: 2V; Drain to Source Resistance: 35mR; Input Capacitance: 1.7nF; Continuous Drain Current (ID): 47A; Case/Package: TO-220; Lead Free: Lead Free; Halogen Free: Halogen Free; Packaging: Rail/Tube; Length: 0.414inch; Min Operating Temperature: -55°C; REACH SVHC: No SVHC; Number of Pins: 3; Width: 0.185inch; Drain to Source Voltage (Vdss): 55V; Power Dissipation: 110W; RoHS Compliant: Yes; Max Operating Temperature: 175°C; Height: 0.6inch; Max Dual Supply Voltage: 55V; Drain to Source Breakdown Voltage: 55V; Mount: Through Hole
NTC = CMP-06022-001050-1: Thermistor NTC 10kΩ ±1% 2-Pin Radial Bulk; Resistance: 10kR; Max Power Dissipation: 7.5mW; Lead Diameter: 0.4mm; RoHS Compliant: Yes; Number of Pins: 2; Lead Free: Lead Free; Height: 2mm; Lead Pitch: 2.5mm; Power Rating: 7.5mW; Series: NXR; Packaging: Bulk; Package Quantity: 500; Width: 4mm; Max Operating Temperature: 125°C; Termination: Radial; Min Operating Temperature: -40°C; Tolerance: 1%; Resistance Tolerance: 1%; Length: 5mm; Mount: Through Hole
OA1 = CMP-014-00004-1: Dual, 16V, 11MHz, rail-to-rail input and output low-offset-voltage low-noise operational amplifier; MF: Texas Instruments; SnapEDA_Link: https://www.snapeda.com/parts/TLV9162IDDFR/Texas+Instruments/view-part/?ref=snap; Case/Package: SOT-23-THN-8 Texas Instruments; Component Type: Standard; Design Item ID: TLV9162IDDFR; MP: TLV9162IDDFR; Pins: 8; Source: TLV9162IDDFR.SchLib; Check_prices: https://www.snapeda.com/parts/TLV9162IDDFR/Texas+Instruments/view-part/?ref=eda; Value: *
OA_I_SENSE = CMP-0187-00480-3: as OA2 on sheet Cell Monitoring; REACH SVHC: No SVHC; Number of Amplifiers: 1; Max Operating Temperature: 125°C; RoHS Compliant: Yes; Min Operating Temperature: -40°C; Number of Elements: 1; Slew Rate-Nom: 0.6V/µs; Mount: Surface Mount; Package Quantity: 3000; Number of Circuits: 1; Lead Free: Lead Free; Height: 1.3mm; Number of Pins: 5; Nominal Supply Current: 100uA; Radiation Hardening: No; Length: 3.1mm; Width: 1.8mm; Packaging: Tape and Reel; Unity Gain Bandwidth Product: 1MHz; Case/Package: SOT-23; Bandwidth: 1MHz; Input Offset Voltage (Vos): 4.5mV; Technology: CMOS
R1 = CMP-009-00018-5: as R11 on sheet Cell Monitoring; Tolerance: 1%; Pins: 2; Min Operating Temperature: -55°C; Case/Package: 0805; Max Operating Temperature: 155°C; RoHS Compliant: True; Mounting Technology: SM
R12 = CMP-03412-040683-1: RES 10kΩ 5.00% 0.2W 0603
R13 = CMP-07231-003646-1: CR0805-FX-3000ELF Thick Film Chip Resistors 0805 300Ω 0.125W 1% 100ppm/°C; Max Power Dissipation: 125mW; Voltage Rating: 150V; Resistance: 300R; Contact Plating: Tin; Number of Terminations: 2; Termination: SMD/SMT; Case Code (Imperial): 0805; Mount: Surface Mount; Length: 2mm; Thickness: 508um; Package Quantity: 1; Case Code (Metric): 2012; Width: 1.25mm; Military Standard: Not; Max Operating Temperature: 155°C; Temperature Coefficient: 100ppm/°C; Min Operating Temperature: -55°C; Features: Moisture Resistant; Radiation Hardening: No; Composition: Thick Film; Height: 0.024inch; Power Rating: 125mW; Depth: 1.25mm; Tolerance: 1%; Packaging: Tape and Reel; Case/Package: 0805
R14 R16 = CMP-03211-002159-1: CRGP0805F18K CRGP0805 18KΩ 0.33W ±100ppm/°C 1% 150V; Manufacturer: TE; Tolerance: 0.01; Device Class L3: Chip SMD Resistors; Value: 18KΩ; ComponentLink2Description: Datasheet; Temperature Range Low: -55°C; Lead Free: Yes; Temperature Coefficient: ±100ppm/°C; Resistance: 18KΩ; Manufacturer Part Number: CRGP0805F18K; Series: CRGP; Temperature: -55°C to +155°C; Ambient Temperature Range High: +70°C; Package: CRGP0805; RoHS: TRUE; Octopart: https://octopart.com/crgp0805f18k-te+connectivity-91018794; Automotive: No; Device Class L2: Resistors; Voltage Rating: 150V; ComponentLink2URL: https://www.mouser.com/datasheet/2/418/NG_DS_9-1773463-9_A-1358566.pdf; Power Rating: 0.33W; Composition: Thick Film; Device Class L1: Passive Components; Category: Res; Ipc Land Pattern Name: RESC200125X55; Height: 0.65mm; Temperature Range High: +155°C
R15 = CMP-04015-026717-1: RN73R2ATTD1001B10 1kΩ ±0.1% 0.125W, 1/8W Chip Resistor 0805 (2012 Metric) Moisture Resistant Thin Film
R17 R18 = CMP-02407-000077-1: MCU08050D2001BP500 RES 1.05K OHM 0.5% 1/5W 0805; Tolerance: 0.1%; Max Power Dissipation: 125mW; Temperature Coefficient: 25ppm/°C; Resistance: 2kR; Package Quantity: 5000; Min Operating Temperature: -55°C; Radiation Hardening: No; Number of Terminations: 2; Width: 0.049inch; Max Operating Temperature: 125°C; Lead Free: Lead Free; Case/Package: 0805; Length: 0.079inch; Composition: Thin Film; Packaging: Tape and Reel; Contact Plating: Tin; Height: 0.022inch; Depth: 1.25mm; Military Standard: Not
SHUNT = CMP-07231-007405-1: RES 0.05 OHM 1% 3W 2512

## Sheet MCU.SchDoc
size A4; SheetNumber: 6; SheetTotal: 8
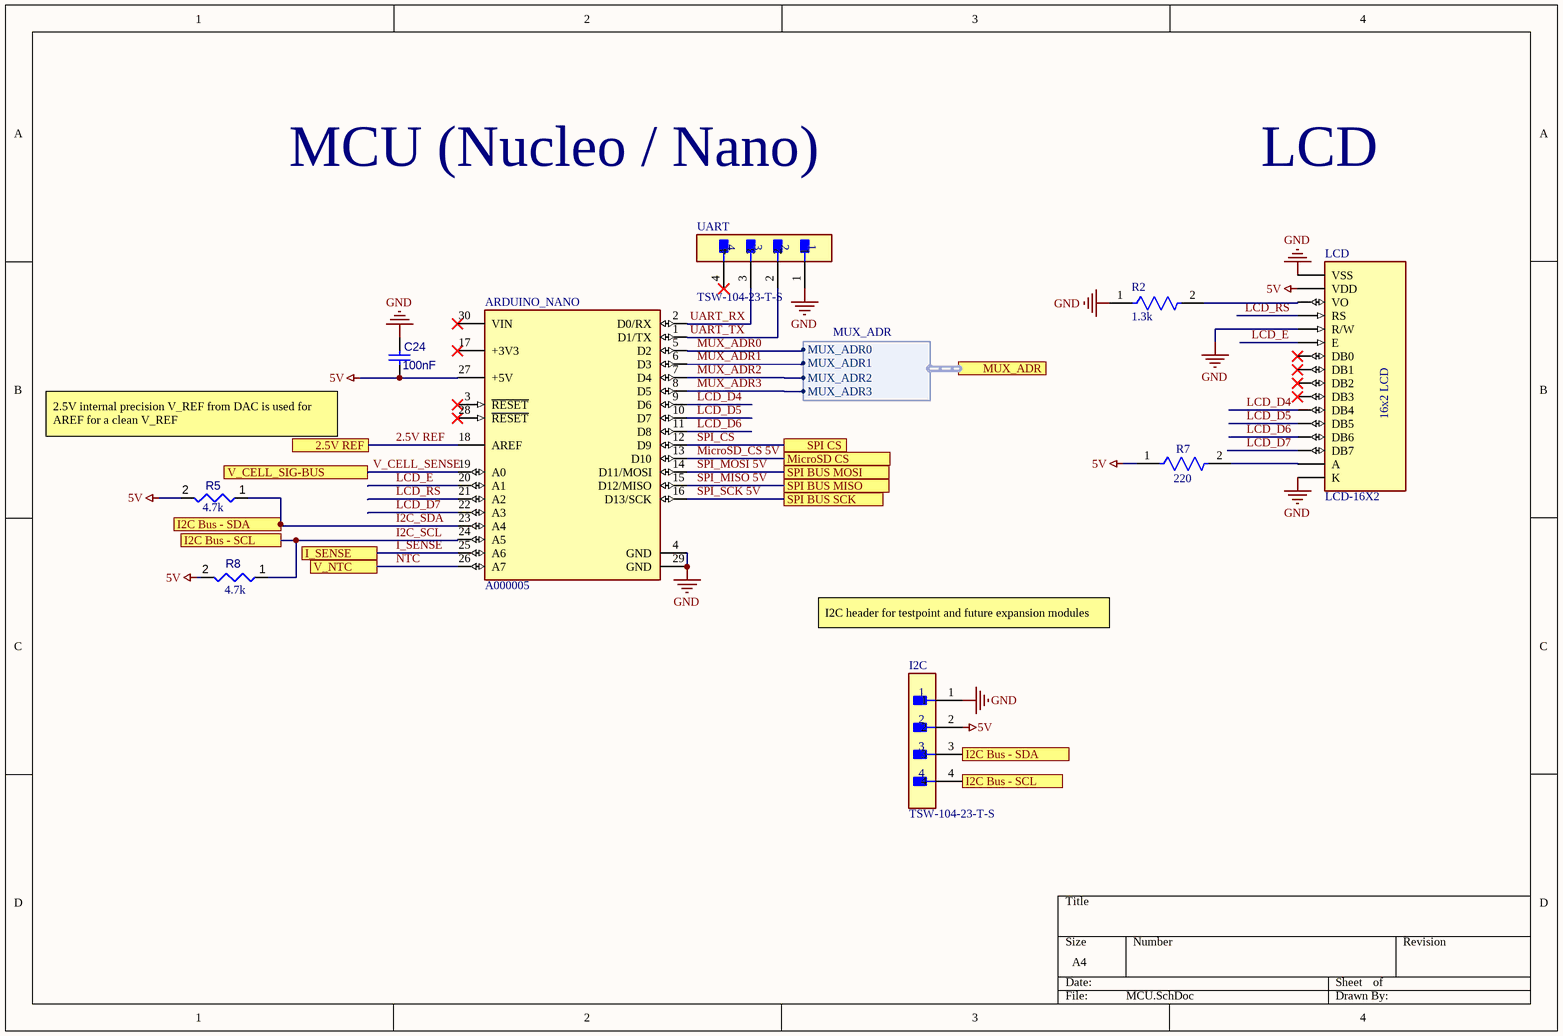
[diagram p5: MCU.SchDoc]

### Parts
ARDUINO_NANO  A000005  [FP-A000005-MFG]
C24  100nF  [CAPC2013X95X50LL10T25]
I2C  TSW-104-23-T-S  [FP-TSW-104-23-T-S-MFG]
LCD  LCD-16X2  [MODULE_LCD-16X2]
R2  1.3k  [FP-RMCF0805-IPC_B]
R5  value 4.7k  [RESC2013X70X40ML20T20]  (hidden comment: Resistor 4k7 +/-1% 0805 125 mW)
R7  220  [FP-RMCF0805-IPC_A]
R8  value 4.7k  [RESC2013X70X40ML20T20]  (hidden comment: Resistor 4k7 +/-1% 0805 125 mW)
UART  TSW-104-23-T-S  [FP-TSW-104-23-T-S-MFG]

### Ports
2.5V REF, I2C Bus - SCL, I2C Bus - SDA, I_SENSE, MicroSD CS, MUX_ADR (harness MUX_ADR), SPI BUS MISO, SPI BUS MOSI, SPI BUS SCK, SPI CS, V_CELL_SIG-BUS, V_NTC

### Harnesses
MUX_ADR: MUX_ADR0, MUX_ADR1, MUX_ADR2, MUX_ADR3

### Nets
5V: ARDUINO_NANO.27(+5V) C24.2 I2C.2 LCD.2(VDD) R5.2 R7.1 R8.2
GND: ARDUINO_NANO.4(GND) ARDUINO_NANO.29(GND) C24.1 I2C.1 LCD.1(VSS) LCD.5(R/W) LCD.16(K) R2.1 UART.1
2.5V REF: ARDUINO_NANO.18(AREF) ; port 2.5V REF
I2C_SCL: ARDUINO_NANO.24(A5) I2C.4 R8.1 ; port I2C Bus - SCL
I2C_SDA: ARDUINO_NANO.23(A4) I2C.3 R5.1 ; port I2C Bus - SDA
I_SENSE: ARDUINO_NANO.25(A6) ; port I_SENSE
LCD_D4: ARDUINO_NANO.9(D6) LCD.11(DB4)
LCD_D5: ARDUINO_NANO.10(D7) LCD.12(DB5)
LCD_D6: ARDUINO_NANO.11(D8) LCD.13(DB6)
LCD_D7: ARDUINO_NANO.22(A3) LCD.14(DB7)
LCD_E: ARDUINO_NANO.20(A1) LCD.6(E)
LCD_RS: ARDUINO_NANO.21(A2) LCD.4(RS)
MicroSD_CS 5V: ARDUINO_NANO.13(D10) ; port MicroSD CS
MUX_ADR0: ARDUINO_NANO.5(D2) ; port MUX_ADR.MUX_ADR0
MUX_ADR1: ARDUINO_NANO.6(D3) ; port MUX_ADR.MUX_ADR1
MUX_ADR2: ARDUINO_NANO.7(D4) ; port MUX_ADR.MUX_ADR2
MUX_ADR3: ARDUINO_NANO.8(D5) ; port MUX_ADR.MUX_ADR3
NTC: ARDUINO_NANO.26(A7) ; port V_NTC  [project net MOSFET_Temp]
SPI_CS: ARDUINO_NANO.12(D9) ; port SPI CS
SPI_MISO 5V: ARDUINO_NANO.15(D12/MISO) ; port SPI BUS MISO
SPI_MOSI 5V: ARDUINO_NANO.14(D11/MOSI) ; port SPI BUS MOSI
SPI_SCK 5V: ARDUINO_NANO.16(D13/SCK) ; port SPI BUS SCK
UART_RX: ARDUINO_NANO.2(D0/RX) UART.3
UART_TX: ARDUINO_NANO.1(D1/TX) UART.2
V_CELL_SENSE: ARDUINO_NANO.19(A0) ; port V_CELL_SIG-BUS  [project net MUX_OUT]
NetLCD_3: LCD.3(VO) R2.2
NetLCD_15: LCD.15(A) R7.2

Not connected (* = marked no-connect by the designer): ARDUINO_NANO 3(~{RESET})* 17(+3V3)* 28(~{RESET})* 30(VIN)*; LCD 7(DB0)* 8(DB1)* 9(DB2)* 10(DB3)*; UART 4*

### Notes on the sheet
- MCU (Nucleo / Nano)
- LCD
- 2.5V internal precision V_REF from DAC is used for AREF for a clean V_REF
- I2C header for testpoint and future expansion modules
- (in symbol CMP-008-000000-1) 16x2 LCD

### Library data of the parts
ARDUINO_NANO = CMP-189986-000002-1: ARDUINO NANO ATMEGA328 EVAL BRD; Number of Bits: 8; Evaluation Kit: Yes; Operating Supply Voltage: 12V; Interface: I2C; Data Bus Width: 8b; Core Architecture: AVR; Packaging: Bulk; Length: 7inch; Package Quantity: 50; Width: 5inch; REACH SVHC: No SVHC; Weight: 0.358383oz; Series: AVR® ATmega; Height: 0.25inch
C24 = CMP-001-00018-6: as C1 on sheet Buck and LDO; Value: 100nF; Pins: 2; Max Operating Temperature: 125°C; Min Operating Temperature: -55°C; Mounting Technology: SM; Case/Package: 0805; RoHS Compliant: True
I2C UART = CMP-02766-001388-1: CONN HEADER VERT 4POS 2.54MM; Number of Contacts: 4; Gender: Male; Connector Type: Male Pin; Max Voltage Rating (AC): 550V; Max Current Rating: 7.6A; Radiation Hardening: No; Lead Free: Lead Free; RoHS Compliant: Yes; Contact Material: Bronze; Number of Positions: 4; Housing Color: Black; Min Operating Temperature: -55°C; Mount: Through Hole; Number of Rows: 1; Orientation: Straight; Contact Mating Length: 0.23inch; Contact Type: Male Pin; REACH SVHC: No SVHC; Max Operating Temperature: 105°C; Color: Black; Pitch: 2.54mm; Length: 10.16mm; Series: TSW; Packaging: Bulk; Contact Plating: Tin; Package Quantity: 1; Termination: Solder; Housing Material: Polyester; Width: 2.54mm; Depth: 2.54mm
LCD = CMP-008-000000-1: Display Development Tools 16x2 Black on Green Char LCD w Backlight; MF: Gravitech; MP: LCD-16X2; Pin Count: 16; Package: None; SnapEDA_Link: https://www.snapeda.com/parts/LCD-16X2/Gravitech/view-part/?ref=snap; Design Item ID: LCD-16X2; Source: LCD-16X2.SchLib; Check_prices: https://www.snapeda.com/parts/LCD-16X2/Gravitech/view-part/?ref=eda; Component Type: Standard; Value: *
R2 = CMP-26527-005916-1: 1.3kΩ ±5% 0.125W 0805 Thick Film Chip Resistor AEC-Q200 compliant; Max Power Dissipation: 125mW; Temperature Coefficient: 200ppm/°C; Resistance: 1.3kR; Mount: Surface Mount; Width: 0.049inch; Case/Package: 0805; Depth: 1.25mm; Case Code (Metric): 2012; Length: 0.079inch; Min Operating Temperature: -55°C; RoHS Compliant: Yes; Features: Automotive AEC-Q200; Number of Terminations: 2; Resistor Type: Thick Film; Packaging: Tape and Reel; Height: 0.026inch; Series: RMCF; Construction: Rectangular; Case Code (Imperial): 0805; Military Standard: Not; Tolerance: 5%; Max Operating Temperature: 155°C; Radiation Hardening: No; Package Quantity: 5000; Contact Plating: Tin
R5 R8 = CMP-009-00032-5: Chip Resistor, 4.7 KOhm, +/- 1%, 0.125 W, -55 to 155 degC, 0805 (2012 Metric); Power: 125mW; Voltage Rating: 150V; Mounting Technology: SM; RoHS Compliant: True; Tolerance: 1%; Min Operating Temperature: -55°C; Max Operating Temperature: 155°C; Case/Package: 0805; Pins: 2
R7 = CMP-26527-006932-1: 220Ω ±5% 0.125W 0805 Thick Film Chip Resistor AEC-Q200 compliant; Resistance: 220R; Max Power Dissipation: 125mW; Temperature Coefficient: 200ppm/°C; Min Operating Temperature: -55°C; Max Operating Temperature: 155°C; Military Standard: Not; Resistor Type: Thick Film; Radiation Hardening: No; Length: 0.079inch; Contact Plating: Tin; Number of Terminations: 2; Depth: 1.25mm; Construction: Rectangular; Width: 0.049inch; Case/Package: 0805; Case Code (Metric): 2012; Tolerance: 5%; Packaging: Tape and Reel; Lead Free: Lead Free; Series: RMCF; RoHS Compliant: Yes; Mount: Surface Mount; Case Code (Imperial): 0805; Features: Automotive AEC-Q200; Height: 0.026inch

## Sheet MicroSD.SchDoc
size A; SheetNumber: 7; SheetTotal: 8
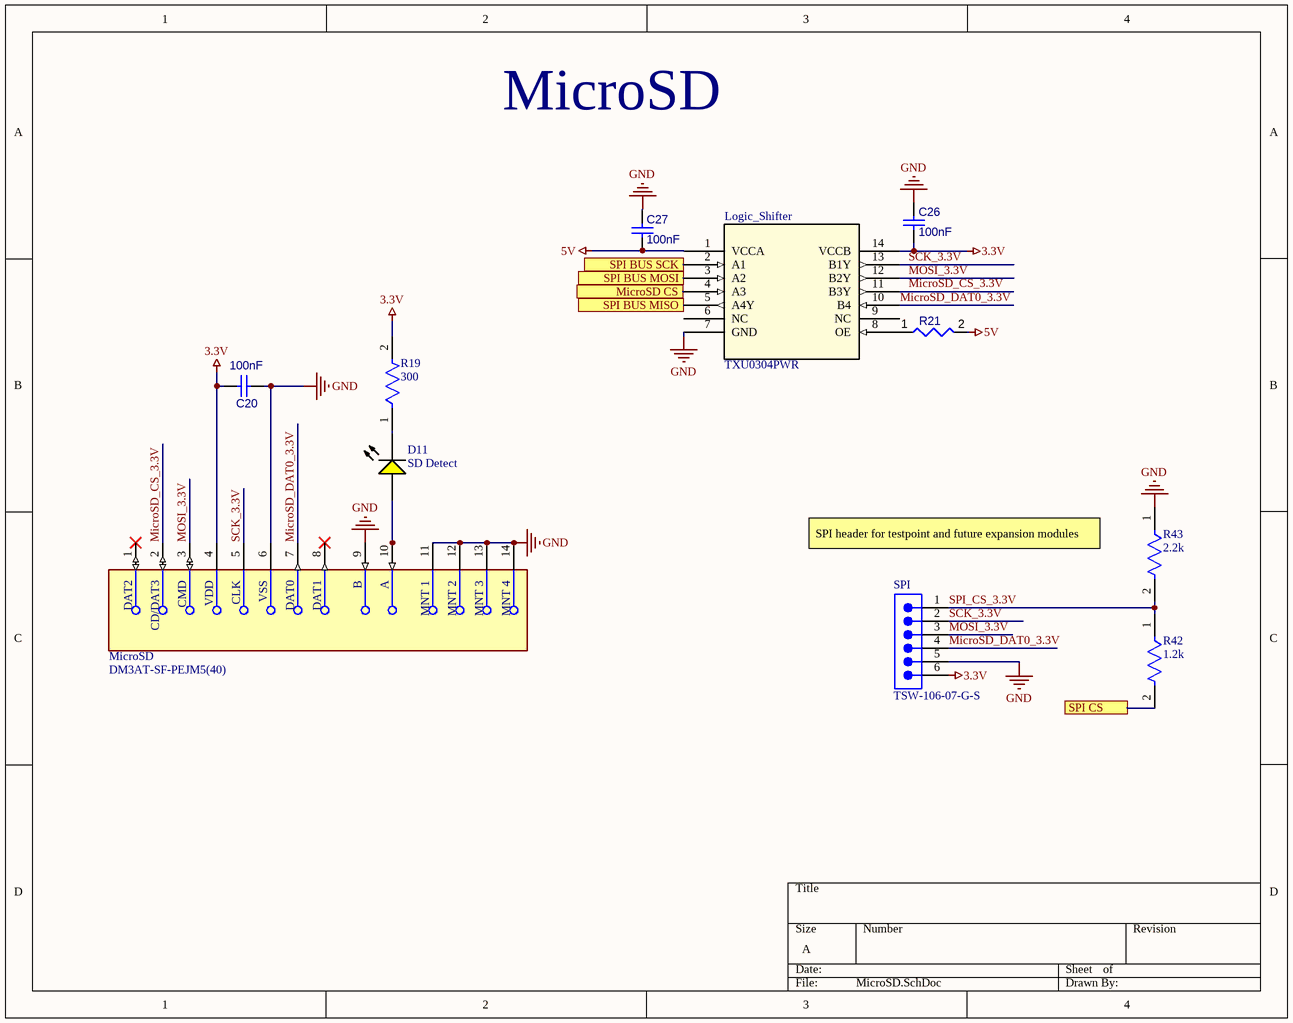
[diagram p6: MicroSD.SchDoc]

### Parts
C20  100nF  [CAPC2013X95X50LL10T25]
C26  100nF  [CAPC2013X95X50LL10T25]
C27  100nF  [CAPC2013X95X50LL10T25]
D11  SD Detect  [LTST-C170KSKT_V]
Logic_Shifter  TXU0304PWR  [TSSOP14_PW_TEX]
MicroSD  DM3AT-SF-PEJM5(40)  [FP-DM3AT-SF-PEJM5_40-MFG]
R19  300  [FP-CR0805-MFG]
R21  Resistor 4k7 +/-1% 0805 125 mW  [RESC2013X70X40ML20T20]  (value not drawn)
R42  1.2k  [FP-CRGCQ0603-IPC_C]
R43  2.2k  [FP-CRGCQ0603-IPC_C]
SPI  TSW-106-07-G-S  [SMTC-TSW-106-07-X-S]

### Ports
MicroSD CS, SPI BUS MISO, SPI BUS MOSI, SPI BUS SCK, SPI CS

### Nets
3.3V: C20.2 C26.2 Logic_Shifter.14(VCCB) MicroSD.4(VDD) R19.2 SPI.6
5V: C27.2 Logic_Shifter.1(VCCA) R21.2
GND: C20.1 C26.1 C27.1 Logic_Shifter.7(GND) MicroSD.6(VSS) MicroSD.9(B) MicroSD.11(MNT_1) MicroSD.12(MNT_2) MicroSD.13(MNT_3) MicroSD.14(MNT_4) R43.1 SPI.5
MicroSD_CS 5V: Logic_Shifter.4(A3) ; port MicroSD CS
MicroSD_CS_3.3V: Logic_Shifter.11(B3Y) MicroSD.2(CD/DAT3)
MicroSD_DAT0_3.3V: Logic_Shifter.10(B4) MicroSD.7(DAT0) SPI.4
MOSI_3.3V: Logic_Shifter.12(B2Y) MicroSD.3(CMD) SPI.3
SCK_3.3V: Logic_Shifter.13(B1Y) MicroSD.5(CLK) SPI.2
SPI_CS: R42.2 ; port SPI CS
SPI_CS_3.3V: R42.1 R43.2 SPI.1
SPI_MISO 5V: Logic_Shifter.5(A4Y) ; port SPI BUS MISO
SPI_MOSI 5V: Logic_Shifter.3(A2) ; port SPI BUS MOSI
SPI_SCK 5V: Logic_Shifter.2(A1) ; port SPI BUS SCK
NetD11_1: D11.1(A) MicroSD.10(A)
NetD11_2: D11.2(K) R19.1
NetLogic_Shifter_8: Logic_Shifter.8(OE) R21.1

Not connected (* = marked no-connect by the designer): Logic_Shifter 6(NC) 9(NC); MicroSD 1(DAT2)* 8(DAT1)*

### Notes on the sheet
- MicroSD
- SPI header for testpoint and future expansion modules

### Library data of the parts
C20 C26 C27 = CMP-001-00018-6: as C1 on sheet Buck and LDO; Value: 100nF; Pins: 2; Max Operating Temperature: 125°C; Min Operating Temperature: -55°C; Mounting Technology: SM; Case/Package: 0805; RoHS Compliant: True
D11 = CMP-2000-06621-1: LTST-C170KSKT LED Yellow, 75 mW, 80 mA, -55 to 85 degC, 2-Pin SMD, RoHS, Tape and Reel; Manufacturer: Lite-On; Main Category: ChipLED; Product Depth (mm): 1.25mm; Dominant Wave Length: 587nm; Viewing Angle: 130deg; Luminous Intensity: 112mcd; Test Current (It): 20mA; Emitting Color: Amber; Chip Material: AlGaInP; Product Height (mm): 1.1mm; Forward Voltage: 2.4V; High Brightness: Yes; Forward Current: 30mA; Number of  Elements: 1; Power Dissipation: 75W; Type: Uni-Color; Shape Type: Rectangular; Peak Wavelength: 588nm; Reverse Voltage: 5V; Rad Hardened: No; Product Length (mm): 2mm; DELETED: Compliant; Package Description: 2-Pin Surface Mount Device, Body 2 x 1.25 mm; Mounting: SurfaceMount; Lum Intensity: 112mcd; Pin Count: 2; Mounting Technology: SurfaceMount; Package Reference: C170KSKT; Datasheet Version: Rev. H, 04/2014; Package Type: ChipLed; Packaging: TapeandReel; Manufacturer URL: http://www.us.liteon.com/; Datasheet URL: http://optoelectronics.liteon.com/upload/download/DS-22-99-0188/S_110_LTST-C170KSKT.pdf; Operating Temp Range: -55Cto85C; Lens Dimensions: 1.4x1.25x0.6mm; Operating Temperature Classification: Industrial
Logic_Shifter = TXU0304PWR: Four-channel fixed multidirectional level shifter 14-TSSOP -40 to 125; Manufacturer_Name: Texas Instruments; Copyright: Copyright (C) 2025 Ultra Librarian. All rights reserved.; Manufacturer_Part_Number: TXU0304PWR; RefDes: RefDes; Type: Type
MicroSD = CMP-11597-000006-1: CONN MICRO SD R/A PUSH-PUSH SMD; Contact Resistance: 100mR; Insulation Resistance: 1GR; Gender: Receptacle; Max Voltage Rating (AC): 125V; Pitch: 1.1mm; Mating Cycles: 10000; Max Current Rating: 500mA; Connector Type: Connector; Number of Contacts: 8; Housing Material: Polymer; Flammability Rating: UL94 V-0; REACH SVHC: No SVHC; Lead Free: Lead Free; Package Quantity: 400; Length: 13.85mm; Number of Rows: 2; Series: DM3; Min Operating Temperature: -25°C; Voltage Rating (AC): 125V; Contact Material: Copper Alloy; Depth: 15.95mm; Contact Plating: Gold; Packaging: Tape and Reel; Width: 13.85mm; Orientation: Right Angle; Color: Black; Voltage Rating: 125V; Radiation Hardening: No; Termination: Solder; Current Rating: 500mA; Mount: Surface Mount; Max Operating Temperature: 85°C
R19 = CMP-07231-003646-1: as R13 on sheet Constant Current Sink; Contact Plating: Tin; Number of Terminations: 2; Termination: SMD/SMT; Case Code (Imperial): 0805; Mount: Surface Mount; Length: 2mm; Thickness: 508um; Package Quantity: 1; Case Code (Metric): 2012; Width: 1.25mm; Military Standard: Not; Max Operating Temperature: 155°C; Temperature Coefficient: 100ppm/°C; Min Operating Temperature: -55°C; Features: Moisture Resistant; Radiation Hardening: No; Composition: Thick Film; Height: 0.024inch; Power Rating: 125mW; Depth: 1.25mm; Tolerance: 1%; Packaging: Tape and Reel; Case/Package: 0805
R21 = CMP-009-00032-5: Chip Resistor, 4.7 KOhm, +/- 1%, 0.125 W, -55 to 155 degC, 0805 (2012 Metric); Value: 4.7k; Voltage Rating: 150V; Power: 125mW; Tolerance: 1%; Mounting Technology: SM; RoHS Compliant: True; Min Operating Temperature: -55°C; Max Operating Temperature: 155°C; Case/Package: 0805; Pins: 2
R42 = CMP-03211-000516-1: CRGCQ0603F1K2; Manufacturer: TE Connectivity; Power Rating: 0.1W; Resistance: 1.2KΩ; Value: 1.2KΩ; Voltage Rating: 75V; Temperature Coefficient: ±100ppm/°C; Tolerance: 0.01; Octopart: https://octopart.com/crgcq0603f1k2-te+connectivity-91018051; ComponentLink2Description: Datasheet; ComponentLink2URL: https://www.te.com/commerce/DocumentDelivery/DDEController?Action=showdoc&DocId=Data+Sheet%7F1773204-3%7F1%7Fpdf%7FEnglish%7FENG_DS_1773204-3_1.pdf%7F4-2176339-710; Category: Res; Temperature: -55°C to +155°C; Temperature Range High: +155°C; Ipc Land Pattern Name: RESC16080X45; Device Class L2: Resistors; Height: 0.55mm; Ambient Temperature Range High: +70°C; RoHS: TRUE; Package: CRGCQ0603; Temperature Range Low: -55°C; Digikey Description: CRGCQ 0603 1K2 1%; Series: CRGCQ; Lead Free: Yes; Manufacturer Part Number: CRGCQ0603F1K2; Device Class L1: Passive Components; Composition: Thick Film; Device Class L3: Chip SMD Resistors
R43 = CMP-03211-010325-1: CRGCQ0603F2K2; Manufacturer: TE Connectivity; Power Rating: 0.1W; Value: 2.2KΩ; Tolerance: 0.01; Temperature Coefficient: ±100ppm/°C; Voltage Rating: 75V; Height: 0.55mm; RoHS: TRUE; Digikey Description: CRGCQ 0603 2K2 1%; Composition: Thick Film; Lead Free: Yes; Device Class L2: Resistors; Device Class L3: Chip SMD Resistors; Temperature Range High: +155°C; ComponentLink2URL: https://www.te.com/commerce/DocumentDelivery/DDEController?Action=showdoc&DocId=Data+Sheet%7F1773204-3%7F1%7Fpdf%7FEnglish%7FENG_DS_1773204-3_1.pdf%7F4-2176339-766; Device Class L1: Passive Components; Package: CRGCQ0603; Manufacturer Part Number: CRGCQ0603F2K2; Temperature: -55°C to +155°C; Temperature Range Low: -55°C; ComponentLink2Description: Datasheet; Resistance: 2.2KΩ; Category: Res; Octopart: https://octopart.com/crgcq0603f2k2-te+connectivity-91018063; Ipc Land Pattern Name: RESC16080X45; Ambient Temperature Range High: +70°C; Series: CRGCQ
SPI = CMP-1024-00383-1: 0.025" SQ Post Header, Through-hole, Vertical, -55 to 125 degC, 2.54 mm Pitch, 6-Pin, Male, RoHS; Manufacturer: Samtec; Pitch: 2.54 mm; RoHS: True; ComponentLink1Description: Manufacturer URL; DatasheetVersion: F-214; Orientation: Vertical; ComponentLink1URL: http://www.samtec.com; ComponentLink3Description: Package Specification; ComponentLink2Description: Datasheet; PackageVersion: DM, 8/1988; PackageDescription: .025[0.64] SQ. Post Terminal Strip Assembly; PackageReference: TSW-106-07-X-S; Mounting Technology: Through-hole; Temperature Range: -55 to 125 degC; ComponentLink3URL: http://www.samtec.com/documents/webfiles/cpdf/TSW-XXX-XX-XXX-X-XX-XXX-MKT.pdf; ComponentLink2URL: http://www.samtec.com/documents/webfiles/pdf/TSW_TH.PDF; PartNumber: TSW-106-07-G-S